# Altium project BLDC_driver_sensorless.PrjPcb
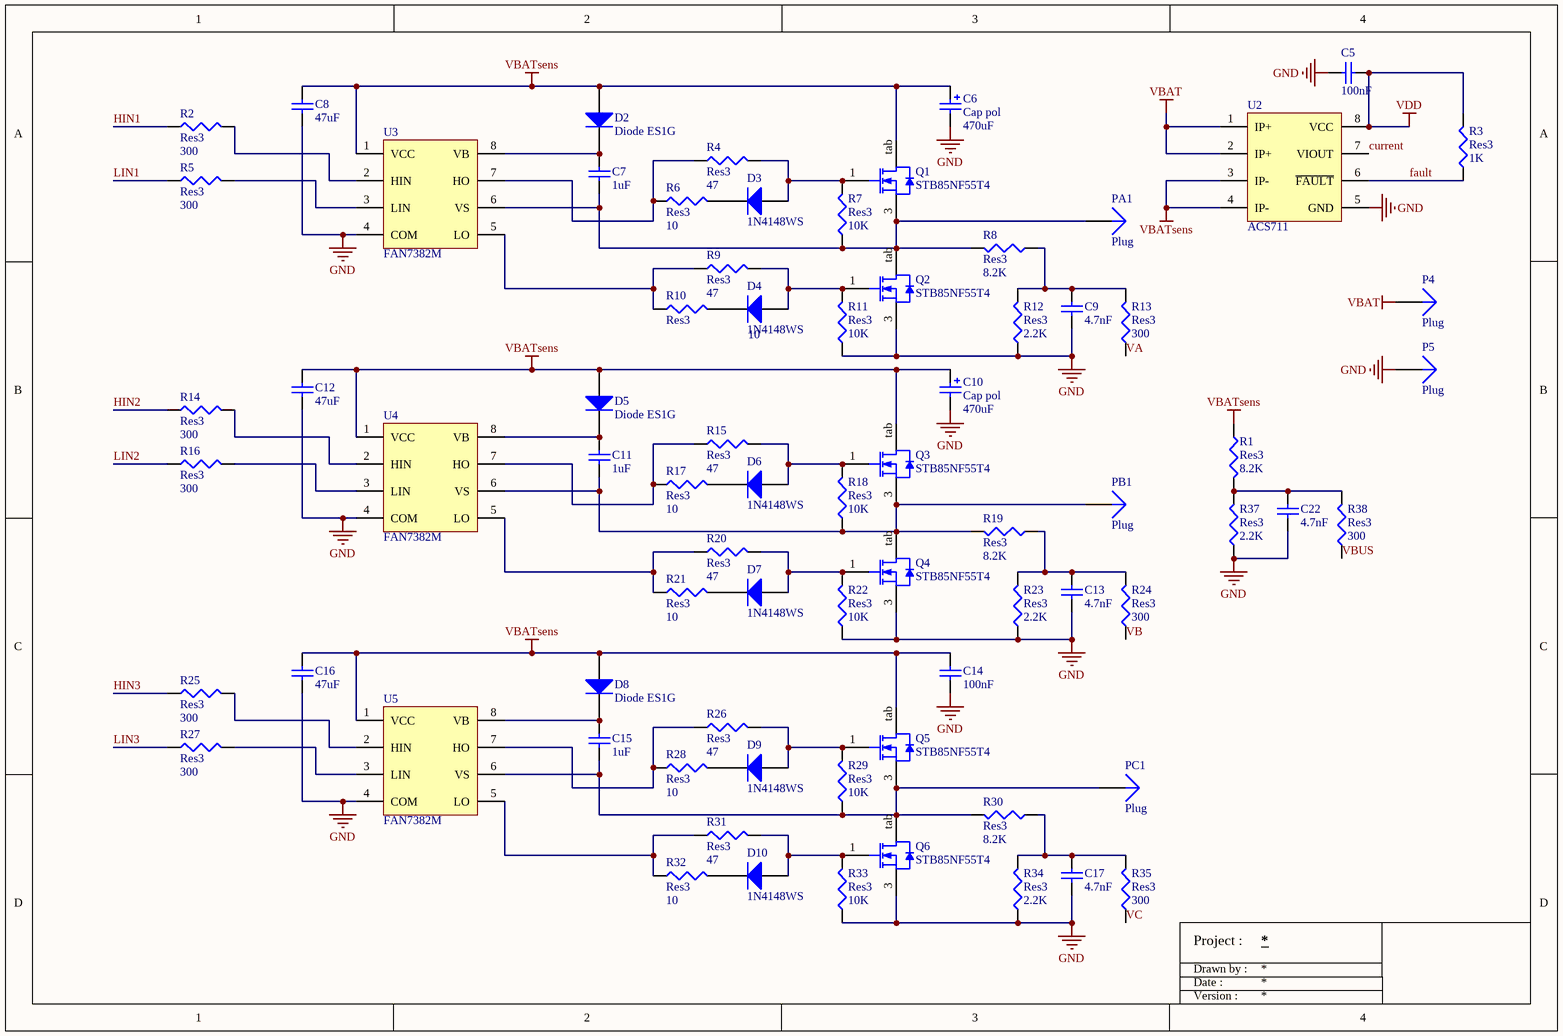
[diagram p0: BLDC_driver_sensorless_power.SchDoc]
1 sheet, 75 parts. Net scope: global (net labels, ports and power ports of the same name join across sheets).
Board files: BLDC_driver_sensorless.PcbDoc, PCB_gravure_x4.PcbDoc, BLDC_driver_sensorless_v2.PcbDoc

## Sheet BLDC_driver_sensorless_power.SchDoc
size A4

### Parts
C5  value 100nF  [1206 capacitor]  (hidden comment: Cap SMD)
C6  Cap pol  value 470uF  [Cap elec 10x16-5 Surface Mount]
C7  value 1uF  [1206 capacitor]  (hidden comment: Cap SMD)
C8  value 47uF  [1206 capacitor]  (hidden comment: Cap SMD)
C9  value 4.7nF  [1206 capacitor]  (hidden comment: Cap SMD)
C10  Cap pol  value 470uF  [Cap elec 10x16-5 Surface Mount]
C11  value 1uF  [1206 capacitor]  (hidden comment: Cap SMD)
C12  value 47uF  [1206 capacitor]  (hidden comment: Cap SMD)
C13  value 4.7nF  [1206 capacitor]  (hidden comment: Cap SMD)
C14  value 100nF  [1206 capacitor]  (hidden comment: Cap SMD)
C15  value 1uF  [1206 capacitor]  (hidden comment: Cap SMD)
C16  value 47uF  [1206 capacitor]  (hidden comment: Cap SMD)
C17  value 4.7nF  [1206 capacitor]  (hidden comment: Cap SMD)
C22  value 4.7nF  [1206 capacitor]  (hidden comment: Cap SMD)
D2  Diode ES1G  [DO-214AC]
D3  1N4148WS  [SOD323]
D4  1N4148WS  [SOD323]
D5  Diode ES1G  [DO-214AC]
D6  1N4148WS  [SOD323]
D7  1N4148WS  [SOD323]
D8  Diode ES1G  [DO-214AC]
D9  1N4148WS  [SOD323]
D10  1N4148WS  [SOD323]
P4  Plug  [PIN1]
P5  Plug  [PIN1]
PA1  Plug  [PIN1]
PB1  Plug  [PIN1]
PC1  Plug  [PIN1]
Q1  STB85NF55T4  [TO-263-2]
Q2  STB85NF55T4  [TO-263-2]
Q3  STB85NF55T4  [TO-263-2]
Q4  STB85NF55T4  [TO-263-2]
Q5  STB85NF55T4  [TO-263-2]
Q6  STB85NF55T4  [TO-263-2]
R1  Res3  value 8.2K  [1206 resistor]
R2  Res3  value 300  [1206 resistor]
R3  Res3  value 1K  [1206 resistor]
R4  Res3  value 47  [1206 resistor]
R5  Res3  value 300  [1206 resistor]
R6  Res3  value 10  [1206 resistor]
R7  Res3  value 10K  [1206 resistor]
R8  Res3  value 8.2K  [1206 resistor]
R9  Res3  value 47  [1206 resistor]
R10  Res3  value 10  [1206 resistor]
R11  Res3  value 10K  [1206 resistor]
R12  Res3  value 2.2K  [1206 resistor]
R13  Res3  value 300  [1206 resistor]
R14  Res3  value 300  [1206 resistor]
R15  Res3  value 47  [1206 resistor]
R16  Res3  value 300  [1206 resistor]
R17  Res3  value 10  [1206 resistor]
R18  Res3  value 10K  [1206 resistor]
R19  Res3  value 8.2K  [1206 resistor]
R20  Res3  value 47  [1206 resistor]
R21  Res3  value 10  [1206 resistor]
R22  Res3  value 10K  [1206 resistor]
R23  Res3  value 2.2K  [1206 resistor]
R24  Res3  value 300  [1206 resistor]
R25  Res3  value 300  [1206 resistor]
R26  Res3  value 47  [1206 resistor]
R27  Res3  value 300  [1206 resistor]
R28  Res3  value 10  [1206 resistor]
R29  Res3  value 10K  [1206 resistor]
R30  Res3  value 8.2K  [1206 resistor]
R31  Res3  value 47  [1206 resistor]
R32  Res3  value 10  [1206 resistor]
R33  Res3  value 10K  [1206 resistor]
R34  Res3  value 2.2K  [1206 resistor]
R35  Res3  value 300  [1206 resistor]
R37  Res3  value 2.2K  [1206 resistor]
R38  Res3  value 300  [1206 resistor]
U2  ACS711  [SOIC8]
U3  FAN7382M  [SOIC8]
U4  FAN7382M  [SOIC8]
U5  FAN7382M  [SOIC8]

### Nets
GND: C5.2 C6.2 C8.1 C9.2 C10.2 C12.1 C13.2 C14.2 C16.1 C17.2 C22.2 P5.1 Q2.3(S) Q4.3(S) Q6.3(S) R11.1 R12.1 R22.1 R23.1 R33.1 R34.1 R37.1 U2.5(GND) U3.4(COM) U4.4(COM) U5.4(COM)
VBAT: P4.1 U2.1(IP+) U2.2(IP+)
VBATsens: C6.1 C8.2 C10.1 C12.2 C14.1 C16.2 D2.A D5.A D8.A Q1.tab(D) Q3.tab(D) Q5.tab(D) R1.1 U2.3(IP-) U2.4(IP-) U3.1(VCC) U4.1(VCC) U5.1(VCC)
VDD: C5.1 R3.2 U2.8(VCC)
current: U2.7(VIOUT)
fault: R3.1 U2.6(~{FAULT})
HIN1: R2.1
HIN2: R14.1
HIN3: R25.1
LIN1: R5.1
LIN2: R16.1
LIN3: R27.1
VA: R13.1
VB: R24.1
VBUS: R38.1
VC: R35.1
NetC7_1: C7.1 D2.K U3.8(VB)
NetC7_2: C7.2 PA1.1 Q1.3(S) Q2.tab(D) R7.1 R8.2 U3.6(VS)
NetC9_1: C9.1 R8.1 R12.2 R13.2
NetC11_1: C11.1 D5.K U4.8(VB)
NetC11_2: C11.2 PB1.1 Q3.3(S) Q4.tab(D) R18.1 R19.2 U4.6(VS)
NetC13_1: C13.1 R19.1 R23.2 R24.2
NetC15_1: C15.1 D8.K U5.8(VB)
NetC15_2: C15.2 PC1.1 Q5.3(S) Q6.tab(D) R29.1 R30.2 U5.6(VS)
NetC17_1: C17.1 R30.1 R34.2 R35.2
NetC22_1: C22.1 R1.2 R37.2 R38.2
NetD3_1: D3.1(A) Q1.1(G) R4.2 R7.2
NetD3_2: D3.2(K) R6.2
NetD4_1: D4.1(A) Q2.1(G) R9.2 R11.2
NetD4_2: D4.2(K) R10.2
NetD6_1: D6.1(A) Q3.1(G) R15.2 R18.2
NetD6_2: D6.2(K) R17.2
NetD7_1: D7.1(A) Q4.1(G) R20.2 R22.2
NetD7_2: D7.2(K) R21.2
NetD9_1: D9.1(A) Q5.1(G) R26.2 R29.2
NetD9_2: D9.2(K) R28.2
NetD10_1: D10.1(A) Q6.1(G) R31.2 R33.2
NetD10_2: D10.2(K) R32.2
NetR2_2: R2.2 U3.2(HIN)
NetR4_1: R4.1 R6.1 U3.7(HO)
NetR5_2: R5.2 U3.3(LIN)
NetR9_1: R9.1 R10.1 U3.5(LO)
NetR14_2: R14.2 U4.2(HIN)
NetR15_1: R15.1 R17.1 U4.7(HO)
NetR16_2: R16.2 U4.3(LIN)
NetR20_1: R20.1 R21.1 U4.5(LO)
NetR25_2: R25.2 U5.2(HIN)
NetR26_1: R26.1 R28.1 U5.7(HO)
NetR27_2: R27.2 U5.3(LIN)
NetR31_1: R31.1 R32.1 U5.5(LO)

### Notes on the sheet
- Drawn by :
- Date :
- Project :
- Version :

### Library data of the parts
C5 C7-C9 C11-C17 C22 = Cap SMD: SMD capacitor
C6 C10 = Cap pol: Capa pol through hole
D2 D5 D8 = Diode ES1G: 1.0A SURFACE MOUNT SUPER-FAST RECTIFIER
D3 D4 D6 D7 D9 D10 = 1N4148WS: Diode commutation
Q1-Q6 = STB85NF55T4: MOSFET Canal-N, 80A 55V
R1-R35 R37 R38 = Res3: Resistor; Published: 8-Jun-2000; LatestRevisionDate: 29-May-2009; LatestRevisionNote: IPC-7351 Footprint Added.; PackageReference: J1-0603; Publisher: Altium Limited; PackageDescription: Chip Resistor
U2 = ACS711: +/-12A HALL EFFECT CURRENT SENSOR
U3-U5 = FAN7382M: High and Low Side Gate Driver
P4 P5 PA1 PB1 PC1 = Plug: LatestRevisionDate: 17-Jul-2002; LatestRevisionNote: Re-released for DXP Platform.; Publisher: Altium Limited